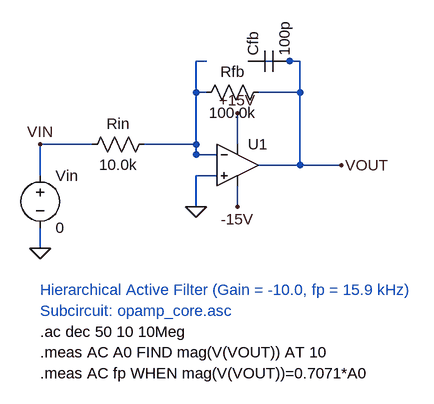
[diagram p0: schematic top_active_filter.asc]
top_active_filter.asc, the LTspice schematic file:
Version 4
SHEET 1 1200 800
WIRE 80 208 80 256
WIRE 80 208 160 208
WIRE 80 336 80 368
WIRE 240 208 320 208
WIRE 320 208 320 224
WIRE 320 224 352 224
WIRE 352 256 320 256
WIRE 320 256 320 304
WIRE 320 224 320 128
WIRE 320 128 336 128
WIRE 416 128 480 128
WIRE 320 128 320 80
WIRE 320 80 336 80
WIRE 400 80 480 80
WIRE 480 80 480 128
WIRE 480 128 480 240
WIRE 416 240 480 240
WIRE 480 240 544 240
WIRE 384 208 384 160
WIRE 384 272 384 304
FLAG 80 208 VIN
FLAG 80 368 0
FLAG 320 304 0
FLAG 544 240 VOUT
FLAG 384 160 +15V
FLAG 384 304 -15V
SYMBOL voltage 80 240 R0
WINDOW 0 24 16 Left 2
WINDOW 3 24 96 Left 2
SYMATTR InstName Vin
SYMATTR Value 0
SYMATTR Value2 AC 1.0
SYMBOL res 256 192 R90
WINDOW 0 0 56 VBottom 2
WINDOW 3 32 56 VTop 2
SYMATTR InstName Rin
SYMATTR Value 10.0k
SYMBOL OpAmps\UniversalOpAmp2 384 240 R0
SYMATTR InstName U1
SYMBOL res 432 112 R90
WINDOW 0 0 56 VBottom 2
WINDOW 3 32 56 VTop 2
SYMATTR InstName Rfb
SYMATTR Value 100.0k
SYMBOL cap 400 96 R270
SYMATTR InstName Cfb
SYMATTR Value 100p
TEXT 80 432 Left 2 ;Hierarchical Active Filter (Gain = -10.0, fp = 15.9 kHz)
TEXT 80 464 Left 2 ;Subcircuit: opamp_core.asc
TEXT 80 496 Left 2 !.ac dec 50 10 10Meg
TEXT 80 528 Left 2 !.meas AC A0 FIND mag(V(VOUT)) AT 10
TEXT 80 560 Left 2 !.meas AC fp WHEN mag(V(VOUT))=0.7071*A0

The netlist it stands for:
* top_active_filter.asc
Vin VIN 0 0 AC 1.0
Rin N001 VIN 10.0k
XU1 0 N001 +15V -15V VOUT level2 Avol=1Meg GBW=10Meg Slew=10Meg Ilimit=25m Rail=0 Vos=0 En=0 Enk=0 In=0 Ink=0 Rin=500Meg  ; pins In+ In- V+ V- OUT
Rfb VOUT N001 100.0k
Cfb VOUT VOUT 100p
* Hierarchical Active Filter (Gain = -10.0, fp = 15.9 kHz)
* Subcircuit: opamp_core.asc
.ac dec 50 10 10Meg
.meas AC A0 FIND mag(V(VOUT)) AT 10
.meas AC fp WHEN mag(V(VOUT))=0.7071*A0
.lib UniversalOpAmp2.lib
.backanno
.end